# EAGLE design untitled (EAGLE 7.7.0)
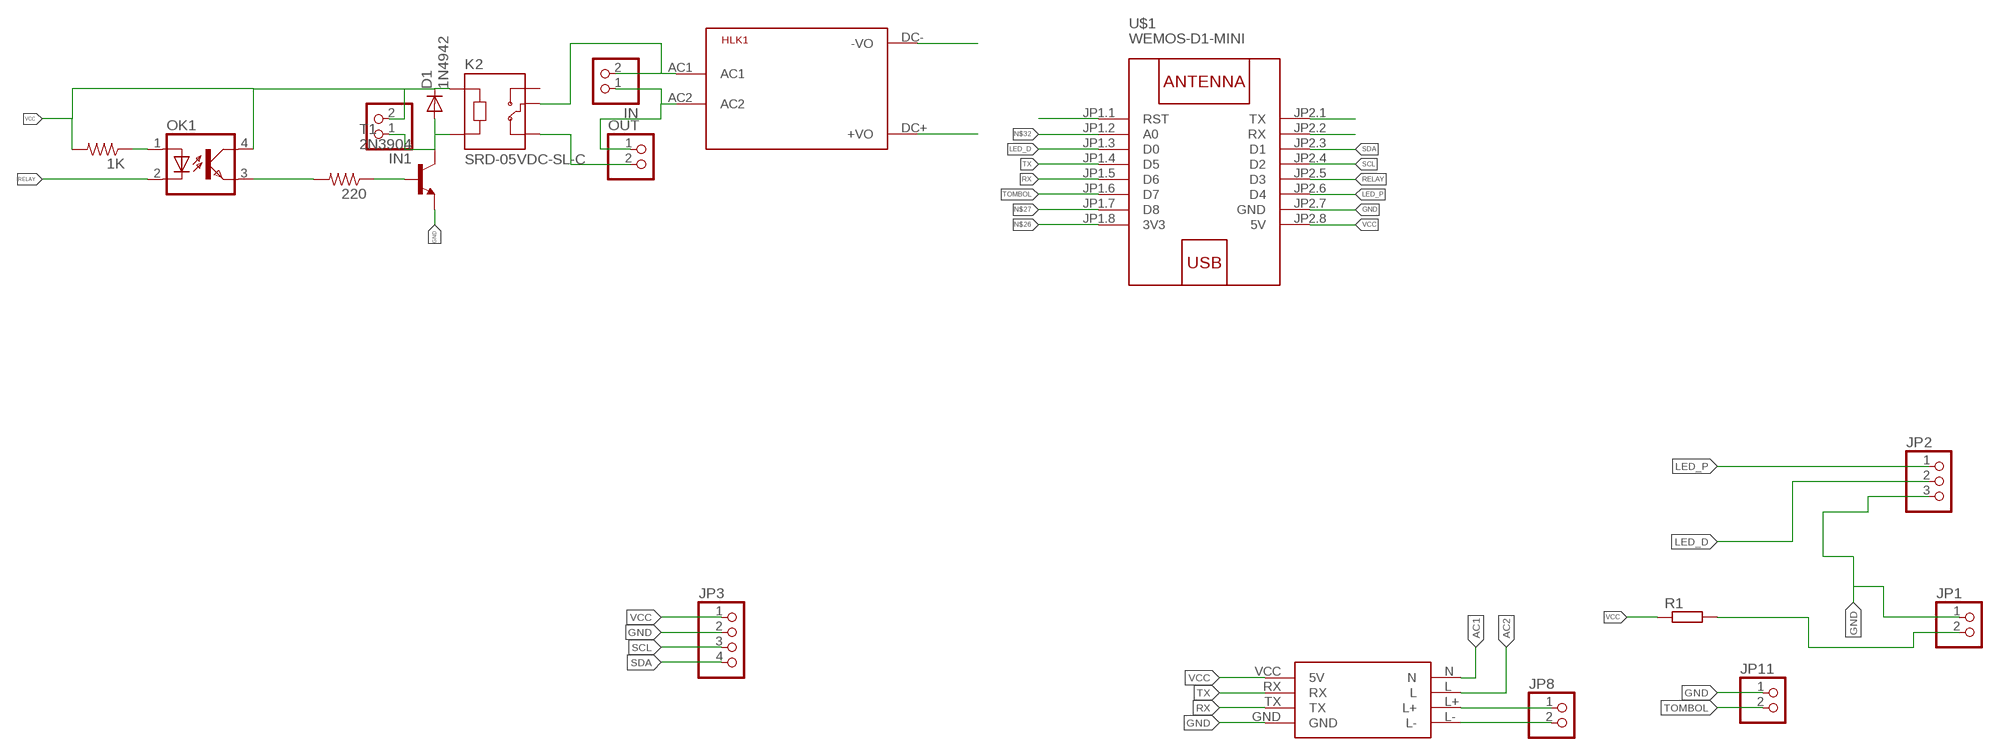
[diagram p0: schematic, sheet 1]

## Parts
1K  R-US_0204/7  [0204/7]
220  R-US_0204/7  [0204/7]
D1  1N4942  [DO41-10]
HLK1  HLK-PM013W  [HLK-PM01]
IN  PINHD-1X2  [1X02]
IN1  PINHD-1X2  [1X02]
JP1  PINHD-1X2  [1X02]
JP2  PINHD-1X3  [1X03]
JP3  PINHD-1X4  [1X04]
JP8  PINHD-1X2  [1X02]
JP11  PINHD-1X2  [1X02]
K2  SRD-05VDC-SL-C  [RELAY_SRD-05VDC-SL-C]
OK1  PC817  [DIL04]
OUT  PINHD-1X2  [1X02]
R1  R-EU_0204/7  [0204/7]
T1  2N3904  [TO92]
U$1  WEMOS-D1-MINI  [WEMOS-D1-MINI]
U$2  PZEM004T  [PZEM004T]

## Nets
AC1: HLK1.AC1 IN.2 K2.COM U$2.N
AC2: HLK1.AC2 IN.1 OUT.1 U$2.L
GND: HLK1.DC-(-VO) JP1.1 JP2.3 JP3.2 JP11.1 T1.3(E) U$1.JP2.7(GND) U$2.GND
LED_D: JP2.2 U$1.JP1.3(D0)
LED_I: JP1.2 R1.2
LED_P: JP2.1 U$1.JP2.6(D4)
N$1: JP8.1 U$2.L+
N$2: JP8.2 U$2.L-
N$5: 220.2 OK1.3(EMIT)
N$7: 1K.1 OK1.1(A)
N$8: D1.A IN1.1 K2.A2 T1.1(C)
N$9: 220.1 T1.2(B)
N$11: U$1.JP1.1(RST)
N$15: U$1.JP2.1(TX)
N$19: K2.NC OUT.2
N$20: U$1.JP2.2(RX)
N$26: U$1.JP1.8(3V3)
N$27: U$1.JP1.7(D8)
N$32: U$1.JP1.2(A0)
RELAY: OK1.2(C) U$1.JP2.5(D3)
RX: U$1.JP1.5(D6) U$2.TX
SCL: JP3.3 U$1.JP2.4(D2)
SDA: JP3.4 U$1.JP2.3(D1)
TOMBOL: JP11.2 U$1.JP1.6(D7)
TX: U$1.JP1.4(D5) U$2.RX
VCC: 1K.2 D1.C HLK1.DC+(+VO) IN1.2 JP3.1 K2.A1 OK1.4(COL) R1.1 U$1.JP2.8(5V) U$2.VCC(5V)
Unconnected: K2.NO

## Library data of the parts
1K 220 = resistor:R-US_: RESISTOR, American symbol
D1 = diode:1N4942: DIODE 1.0 A, 200 V, 150 ns
HLK1 = HLK-PM01:HLK-PM01: Hi-Link Power Supply HLK-PM01 3W Author: Ahmed Said <https://github.com/AhmedSaid/EAGLELibraries>
IN IN1 JP1 JP8 JP11 OUT = pinhead:PINHD-1X2: PIN HEADER
JP2 = pinhead:PINHD-1X3: PIN HEADER
JP3 = pinhead:PINHD-1X4: PIN HEADER
K2 = SRD-05VDC-SL-C:SRD-05VDC-SL-C: 5V Trigger Relay Module For Arduino And Raspberry Pi 5V Trigger Relay Module For Arduino And Raspberry Pi Check availability <https://pricing.snapeda.com/parts/SRD-05VDC-SL-C/Songle%20Relay/view-part?ref=eda>; AVAILABILITY: Not in stock; DESCRIPTION: 5V Trigger Relay Module For Arduino And Raspberry Pi 5V Trigger Relay Module For Arduino And Raspberry Pi; MF: Songle Relay; MP: SRD-05VDC-SL-C; PACKAGE: None; PRICE: None
OK1 = optocoupler:PC817: SHARP OPTO COUPLER
R1 = rcl:R-EU_: RESISTOR, European symbol
T1 = transistor:2N3904: NPN TRANSISTOR
U$1 = diy-modules:WEMOS-D1-MINI: WEMOS D1 mini: Mini Wi-Fi Board based on ESP-8266 device More details can be found here: https://www.wemos.cc/product/d1-mini.html Click here to find device on ebay.com <http://www.ebay.com/sch/wemos+d1+mini+nodemcu>
U$2 = pzem004tmy:PZEM004T

## Board
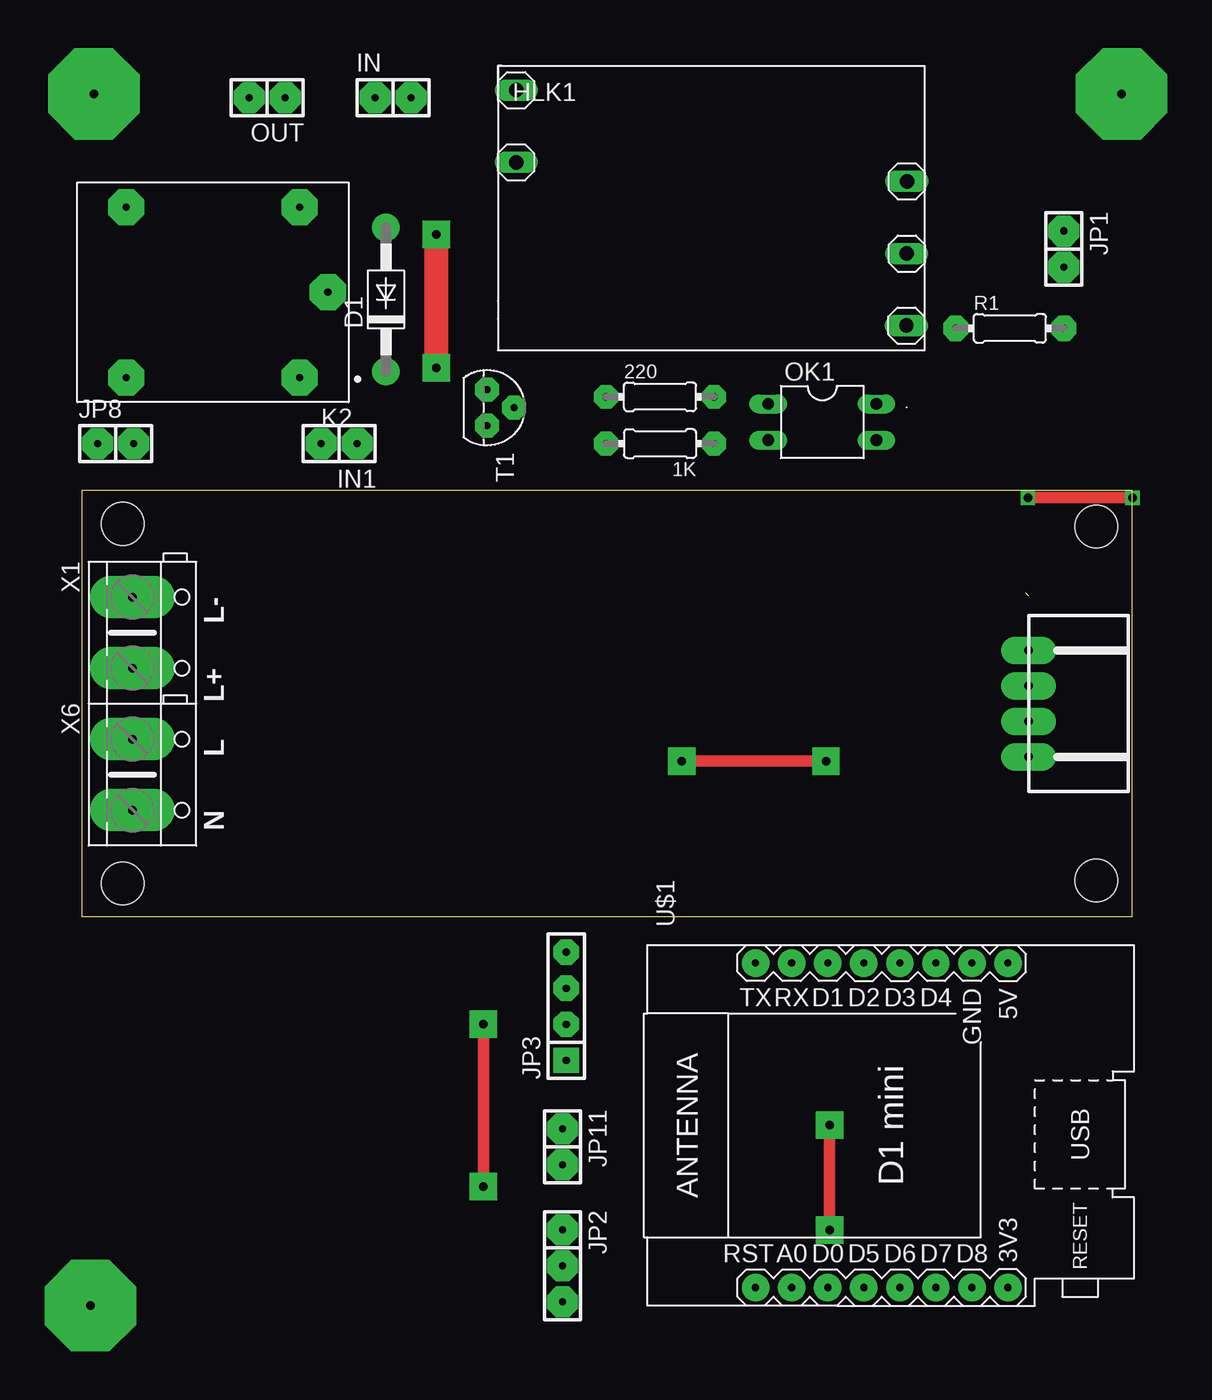
[diagram p1: board, top side]
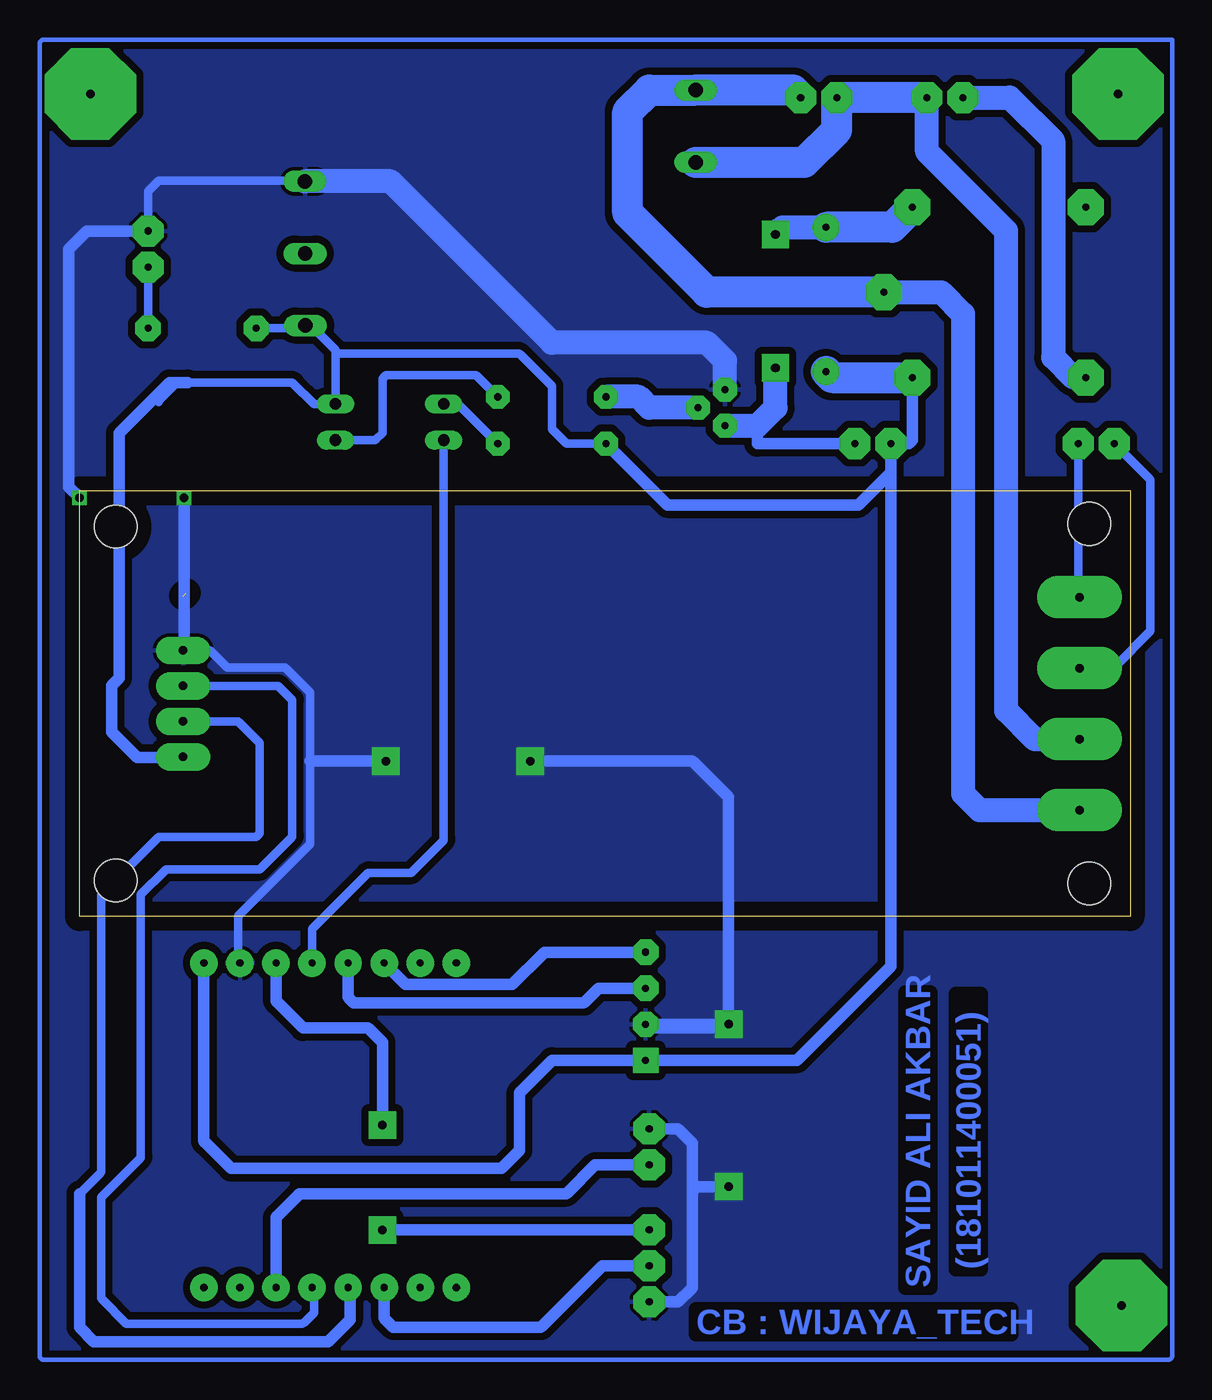
[diagram p2: board, bottom side, seen from below]

Size 74 x 30 mm. Coordinates in mm from the lower left corner, seen from the top.
Copper layers (1*16): Top 0.035mm / dielectric 1.5mm / Bottom 0.035mm
Design rules "default *": minimum track width 10mil, minimum drill 24mil, track to track 20mil, track to pad 20mil, pad to pad 20mil, via to via 20mil, smd to smd 8mil, copper to edge 40mil, drill to drill 20mil, minimum pad ring 10mil, minimum via ring 8mil, stop-mask expansion 4mil, vias tented up to drill 0mil, thermal gap 10mil

### Footprints (pad centres in the part's own frame; a part is rotated, then mirrored left to right if it is on the bottom)
0204/7 = drill 0.5 pad 1.676 octagon: 1 -3.81,0; 2 3.81,0
DO41-10 = drill 0.5 pad 1.93: A 5.08,0; C -5.08,0
HLK-PM01 = drill 1.016 long: 7 11.791,-3.111; AC1 -15.723,8.392; AC2 -15.723,3.312; DC+ 11.765,-8.189; DC- 11.803,1.968
1X02 = drill 0.5 pad 2.184 octagon: 1 -1.27,0; 2 1.27,0
1X03 = drill 0.5 pad 2.184 octagon: 1 -2.54,0; 2 0,0; 3 2.54,0
1X04 = drill 0.5 pad 1.778 square: 1 -3.81,0 | drill 0.5 pad 1.778 octagon: 2 -1.27,0; 3 1.27,0; 4 3.81,0
RELAY_SRD-05VDC-SL-C = drill 0.5 pad 2.54 octagon: A1 -6.1,6; A2 -6.1,-6; COM -8.1,0; NC 6.1,6; NO 6.1,-6
DIL04 = drill 0.813 long: 1 -1.27,-3.81; 2 1.27,-3.81; 3 1.27,3.81; 4 -1.27,3.81
0204/7' = drill 0.5 pad 1.778 octagon: 1 -3.81,0; 2 3.81,0
TO92 = drill 0.5 pad 1.676 octagon: 1 1.27,0; 2 0,1.905; 3 -1.27,0
WEMOS-D1-MINI = drill 0.5 pad 1.93: JP1.1 -11.43,9.525; JP1.2 -11.43,6.985; JP1.3 -11.43,4.445; JP1.4 -11.43,1.905; JP1.5 -11.43,-0.635; JP1.6 -11.43,-3.175; JP1.7 -11.43,-5.715; JP1.8 -11.43,-8.255; JP2.1 11.43,9.525; JP2.2 11.43,6.985; JP2.3 11.43,4.445; JP2.4 11.43,1.905; JP2.5 11.43,-0.635; JP2.6 11.43,-3.175; JP2.7 11.43,-5.715; JP2.8 11.43,-8.255
PZEM004T = drill 0.6 pad 1.93 long: GND 7.303,11.25; RX 7.303,16.25; TX 7.303,13.75; VCC 7.303,18.75 | drill 0.6 pad 3 long: L 70.435,17.5; L+ 70.435,12.5; L- 70.435,7.5; N 70.435,22.5 | hole 3: 2.54,27.46; 2.54,2.54; 71.14,27.66; 71.14,2.34

### Placement (x,y rotation side)
1K  40.73,33.3 180 top  (outside the outline)
220  40.73,36.6 0 top  (outside the outline)
D1  21.42,43.46 90 top  (outside the outline)
HLK1  46.31,49.81 0 top  (outside the outline)
IN  21.93,57.69 0 top  (outside the outline)
IN1  18.12,33.3 180 top  (outside the outline)
JP1  69.17,47.02 270 top  (outside the outline)
JP2  33.87,-24.61 270 top  (outside the outline)
JP3  34.12,-6.32 90 top
JP8  2.37,33.3 0 top  (outside the outline)
JP11  33.87,-16.23 270 top  (outside the outline)
K2  9.23,43.97 180 top  (outside the outline)
OK1  52.16,34.83 270 top  (outside the outline)
OUT  13.04,57.69 180 top  (outside the outline)
R1  [0204/7']  65.36,41.43 0 top  (outside the outline)
T1  28.53,35.84 270 top  (outside the outline)
U$1  56.98,-14.7 90 top  (outside the outline)
U$2  74,30 180 top

### Tracks (layer width: path | path; a pad name or v marks a point on that pad's centre or on a via)
AC1
  Bottom 1.676: K2.COM 13.29,43.97 11.77,42.45 11.77,8.66 10.61,7.5 U$2.N
  Bottom 2.184: IN.2 23.72,58.2 HLK1.AC1 33.86,58.2 35.39,56.67 35.39,49.56 29.8,43.97 K2.COM
AC2
  Bottom 1.676: U$2.L 3.59,12.47 6.69,12.47 8.72,14.51 8.72,48.29 14.31,53.88 OUT.1
  Bottom 2.184: OUT.1 IN.1 20.66,55.4 22.95,53.11 30.58,53.11 HLK1.AC2
GND  (via drill 0.6, 0.6 pad 1.93)
  Top 0.813: v28.28,-7.59 v28.28,-19.02 | v42.25,10.95 v52.41,10.95 | v66.63,29.49 v74,29.49
  Bottom 0.61: HLK1.DC- arc-45 58.27,51.84 68.41,51.84 69.1,51.16 arc-45 69.17,50.98 JP1.1 | U$1.JP2.7 62.75,-3.22 arc45 62.82,-3.04 62.82,0.03 57.82,5.03 arc-45 57.74,5.21 57.74,10.95 57.74,15.78 59.45,17.48 arc-45 59.63,17.55 63.59,17.55 64.71,18.68 arc-45 64.89,18.75 U$2.GND
  Bottom 0.813: JP2.3 31.84,-27.15 30.89,-26.21 arc-45 30.82,-26.03 30.82,-19.53 | 30.82,-19.53 30.82,-15.97 31.76,-15.03 arc-45 31.94,-14.96 JP11.1 | v28.28,-7.59 JP3.2 33.94,-7.77 arc-45 33.76,-7.85 28.03,-7.85 28.21,-7.67 arc45 28.28,-7.49 28.28,8.41 30.75,10.88 arc-45 30.93,10.95 v42.25,10.95 | v28.28,-19.02 30.31,-19.02 arc-90 30.82,-19.53 | v52.41,10.95 57.74,10.95 | U$2.GND 66.63,18.81 v66.63,29.49 | v74,29.49 74.76,30.25 74.76,47.02 73.49,48.29 JP1.1
  Bottom 1.676: T1.3 28.53,39.14 29.8,40.41 40.73,40.41 52.09,51.78 HLK1.DC-
  pour Bottom: -2.96,61.75 76.54,61.75 arc-90 76.79,61.5 76.79,-30.96 76.61,-31.14 arc-45 76.43,-31.21 74.51,-31.21 -1.69,-31.21 -2.71,-31.21 arc-90 -2.96,-30.96 -2.96,-25.88
LED_D
  Bottom 0.813: JP2.2 37.17,-24.61 41.41,-28.85 arc45 41.59,-28.93 51.9,-28.93 52.46,-28.37 arc45 52.54,-28.19 U$1.JP1.3
LED_I
  Bottom 0.61: R1.2 JP1.2
LED_P  (via drill 0.6 pad 1.93)
  Top 0.813: v52.66,-22.07 v52.66,-14.7
  Bottom 0.813: JP2.1 v52.66,-22.07 | v52.66,-14.7 52.66,-8.86 53.61,-7.92 arc-45 53.79,-7.85 58.25,-7.85 60.08,-6.02 arc45 60.16,-5.84 U$1.JP2.6
N$1
  Bottom 0.61: JP8.1 -1.36,30.84 arc45 -1.44,30.66 -1.44,20.09 1.08,17.57 arc45 1.26,17.5 U$2.L+
N$2
  Bottom 0.61: U$2.L- U$2.L- arc45 3.64,22.68 JP8.2
N$4  (via drill 0.6 pad 6.45)
  other vias: 0.85,57.94
N$5
  Bottom 0.61: 220.2 45.99,38.05 arc-45 46.17,38.13 52.41,38.13 52.59,37.95 arc-45 52.66,37.77 52.66,34.06 53.1,33.63 arc45 53.28,33.56 OK1.3
N$6
  Bottom 0.305: -2.96,61.75 76.54,61.75 arc-90 76.79,61.5 76.79,-30.96 arc-90 76.54,-31.21 -2.71,-31.21 arc-90 -2.96,-30.96 -2.96,61.75
N$7
  Bottom 0.61: 1K.1 47.26,36.02 arc-45 47.44,36.1 OK1.1
N$8  (via drill 0.6 pad 1.93)
  Top 1.676: v24.98,38.64 v24.98,48.03
  Bottom 0.813: IN1.1 26.25,33.3 26.25,34.57
  Bottom 1.676: T1.1 26.25,34.57 24.98,35.84 v24.98,38.64 | v24.98,48.03 24.47,48.54 D1.A
  Bottom 2.184: K2.A2 16.76,48.54 D1.A
N$9
  Bottom 1.676: T1.2 33.87,35.84 34.63,36.6 220.1
N$12  (via drill 0.6 pad 6.45)
  other vias: 0.59,-27.4
N$13  (via drill 0.6 pad 6.45)
  other vias: 73.24,57.94
N$19
  Bottom 1.676: OUT.2 8.47,57.69 5.42,54.64 5.42,39.4 3.99,37.97 K2.NC
RELAY
  Bottom 0.61: U$1.JP2.5 57.62,-0.97 arc45 57.54,-0.79 53.75,3 arc45 53.58,3.08 50.63,3.08 48.42,5.29 arc-45 48.35,5.47 OK1.2
RX
  Bottom 0.61: U$1.JP1.5 57.56,-26.19 arc45 57.49,-26.37 57.49,-27.91 58.18,-28.6 arc45 58.36,-28.67 70.7,-28.67 72.4,-26.97 arc45 72.48,-26.79 72.48,-19.78 69.76,-17.06 arc-45 69.68,-16.88 69.68,1.55 67.98,3.26 arc45 67.8,3.33 61.3,3.33 59.09,5.54 arc-45 59.01,5.72 59.01,15.27 59.92,16.18 arc-45 60.1,16.25 U$2.TX
SCL
  Bottom 0.813: JP3.3 37.42,-5.05 38.37,-5.99 arc45 38.55,-6.07 54.7,-6.07 55,-5.76 arc45 55.08,-5.58 U$1.JP2.4
SDA
  Bottom 0.813: U$1.JP2.3 51.09,-4.72 arc-45 50.91,-4.8 43.52,-4.8 41.31,-2.59 arc45 41.13,-2.51 JP3.4
TOMBOL
  Bottom 0.813: U$1.JP1.6 60.16,-21.29 arc45 60.08,-21.11 58.58,-19.6 arc45 58.4,-19.53 39.82,-19.53 arc-45 39.64,-19.46 37.68,-17.5 JP11.2
TX
  Bottom 0.61: U$1.JP1.4 55.02,-26.19 arc45 54.95,-26.37 | 74,-19.53 72.55,-18.08 arc-45 72.48,-17.9 72.48,1.55 68.49,5.54 arc45 68.31,5.62 61.55,5.62 61.37,5.8 arc-45 61.3,5.98 61.3,12.22 62.76,13.68 arc-45 62.94,13.75 U$2.RX
  Bottom 0.813: 54.95,-26.37 54.95,-28.42 56.47,-29.94 72.98,-29.94 74,-28.93 74,-19.53
VCC
  Bottom 0.61: 55.97,39.65 OK1.4 57.49,36.1 58.94,37.55 arc-45 59.12,37.62 66.38,37.62 67.14,37.62 68.34,36.42 arc-45 68.41,36.25 | 55.97,39.65 55.97,39.91 57.61,41.55 arc-45 57.79,41.62 HLK1.DC+ 58.2,41.5 arc45 58.38,41.43 R1.1 | U$2.VCC arc45 66.81,11.2 | 1K.2 39.71,33.3 40.65,34.24 arc45 40.73,34.42 40.73,37.37 42.94,39.58 arc-45 43.12,39.65 55.97,39.65
  Bottom 0.813: U$1.JP2.8 65.24,-15.74 arc-45 65.16,-15.92 63.33,-17.75 44.39,-17.75 arc-45 44.21,-17.68 43.01,-16.48 43.01,-12.52 arc45 42.94,-12.34 40.73,-10.13 JP3.1 23.45,-10.13 16.85,-3.53 IN1.2 | K2.A1 15.33,33.56 15.58,33.3 IN1.2 | 1K.2 32.6,28.98 19.14,28.98 16.85,31.27 IN1.2 | 66.81,11.2 69.94,11.2 71.71,12.98 71.71,16.28 71.21,16.79 71.21,34.06 67.65,37.62 66.38,37.62
  Bottom 2.184: D1.C 21.01,37.97 K2.A1

### Text on the board
Bottom: (181011400051) | SAYID ALI AKBAR | CB : WIJAYA_TECH